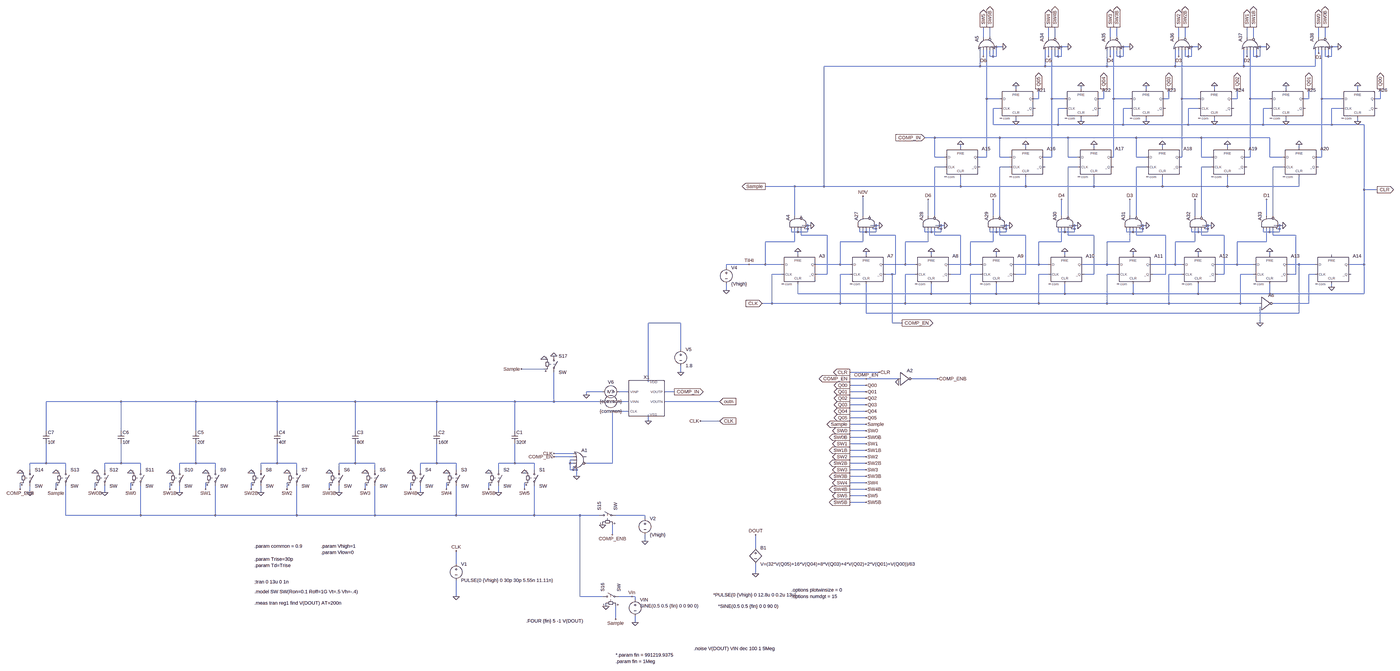
[diagram p0: schematic saradc.asc, whole sheet]
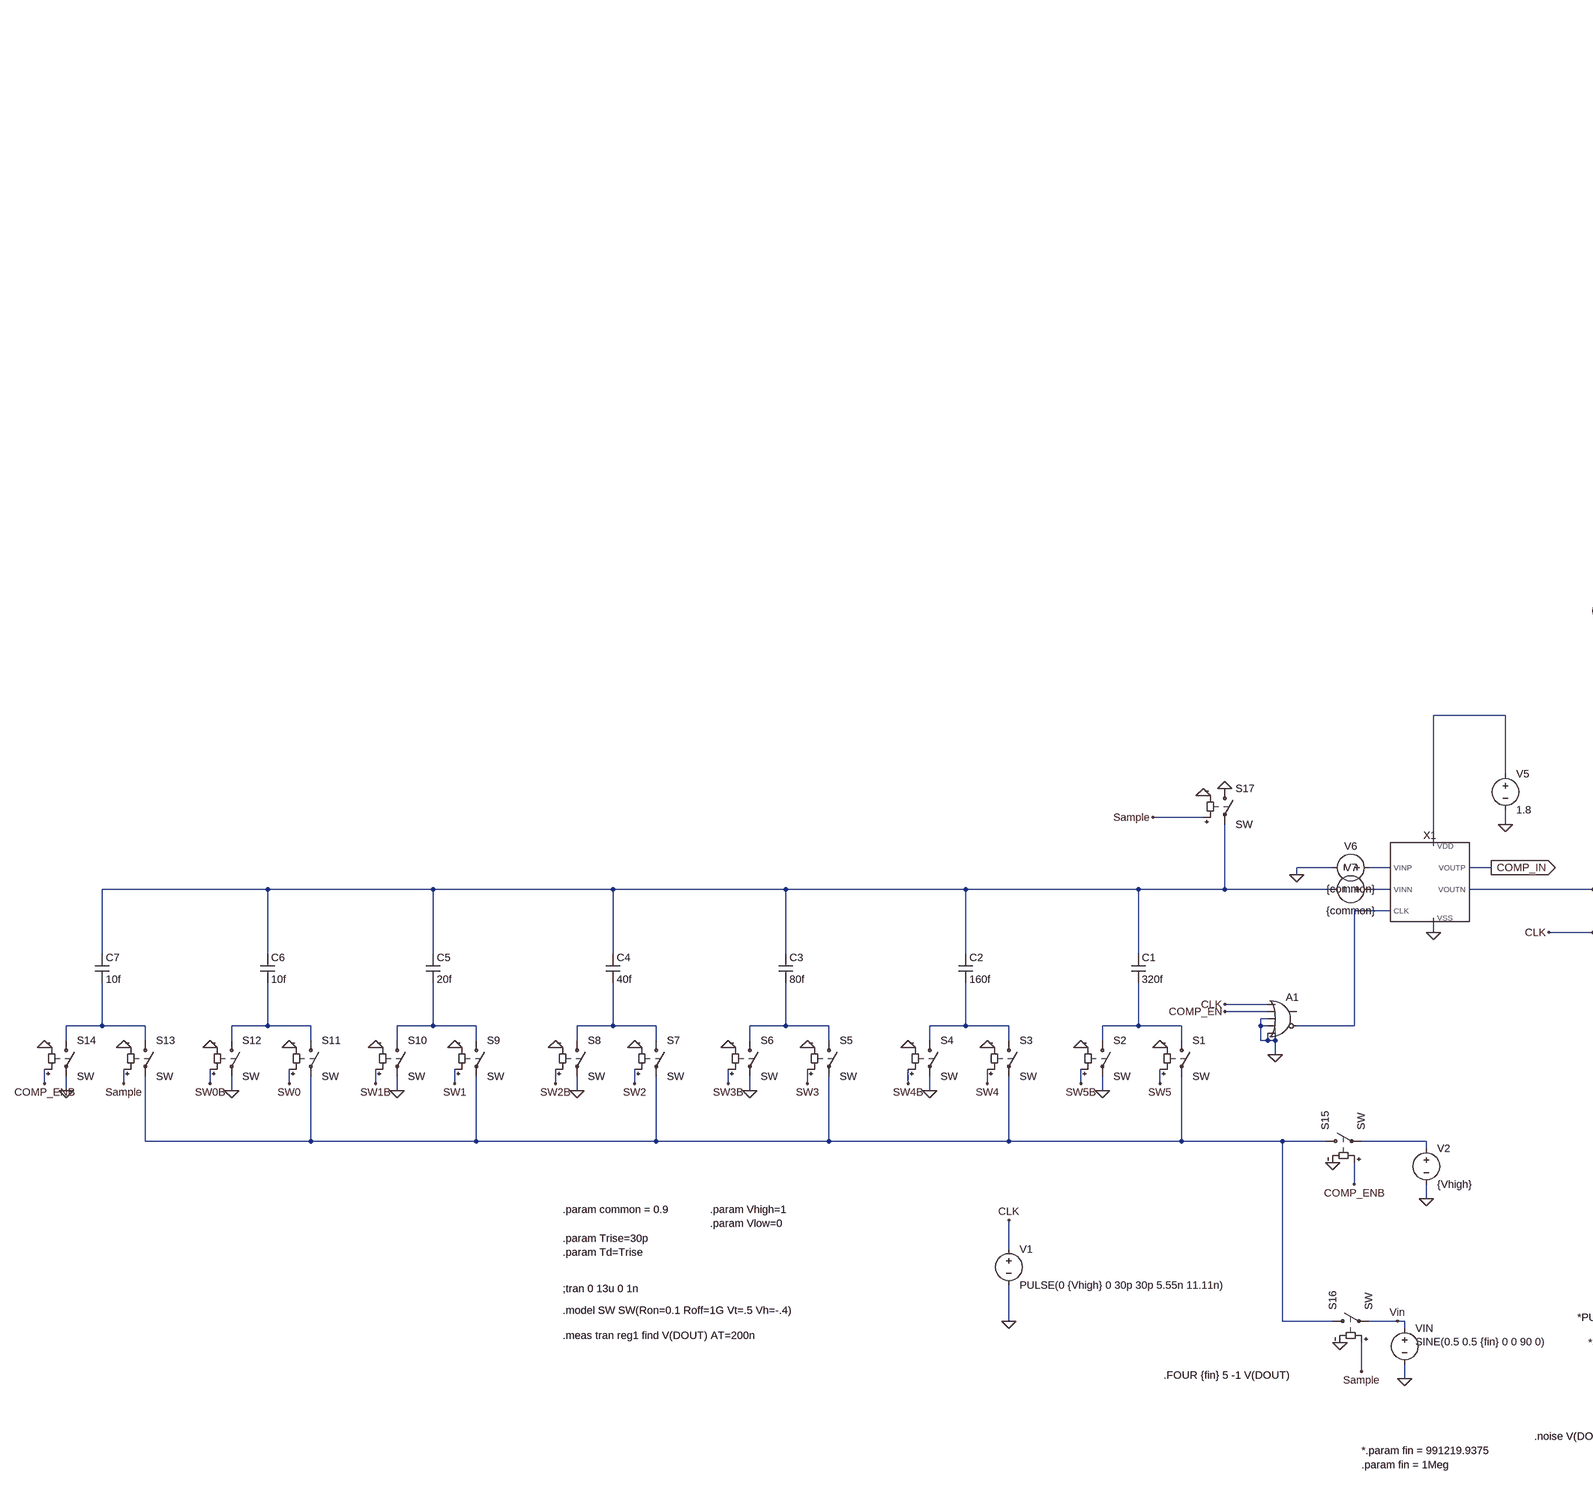
[diagram p1: schematic saradc.asc, part, row 1 of 1, column 1 of 2]
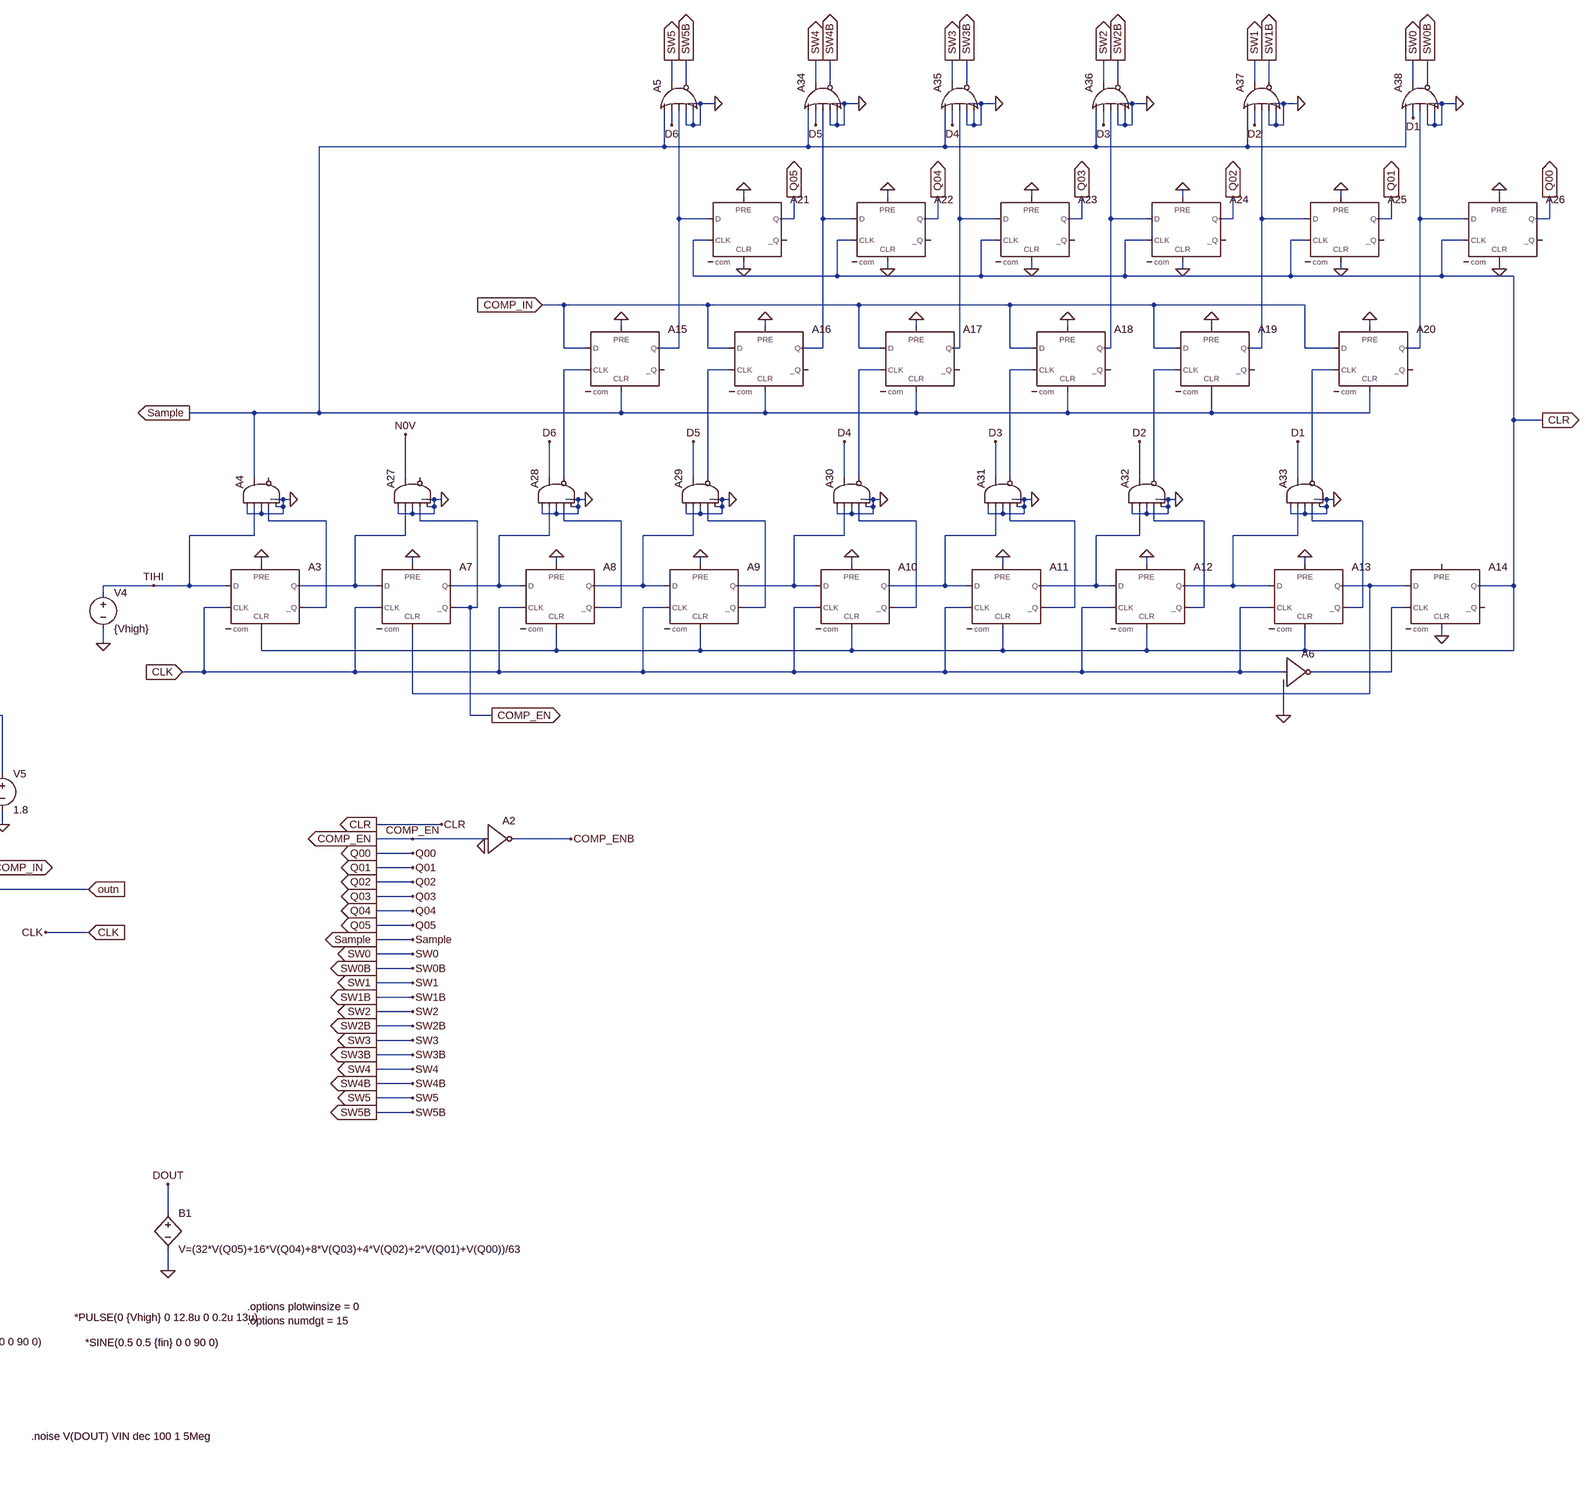
[diagram p2: schematic saradc.asc, part, row 1 of 1, column 2 of 2]
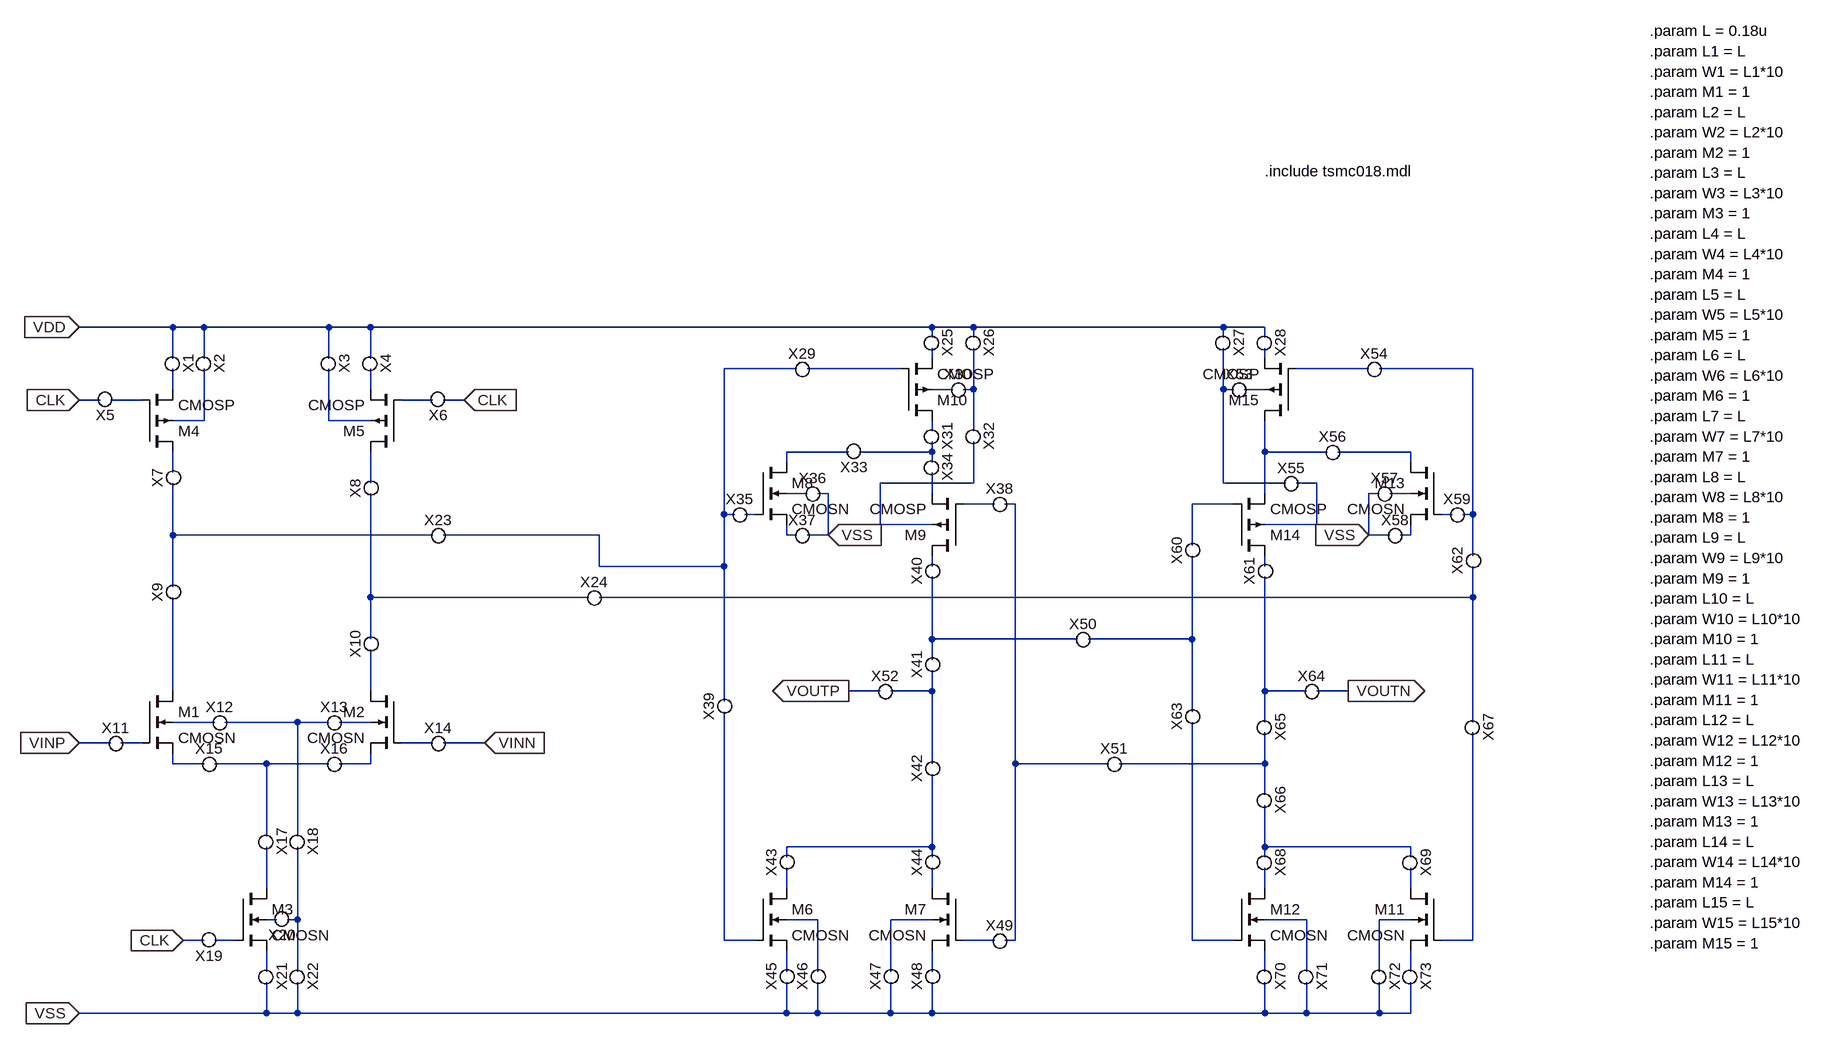
[diagram p3: sub-circuit my_comparator.asc]
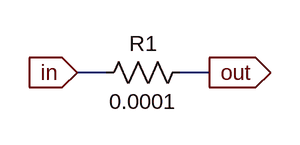
[diagram p4: sub-circuit para_register.asc]
saradc.asc, the LTspice schematic file:
Version 4
SHEET 1 4660 1216
WIRE 2576 -1872 2576 -1920
WIRE 2608 -1872 2608 -1920
WIRE 2896 -1872 2896 -1920
WIRE 2928 -1872 2928 -1920
WIRE 3200 -1872 3200 -1920
WIRE 3232 -1872 3232 -1920
WIRE 3536 -1872 3536 -1920
WIRE 3568 -1872 3568 -1920
WIRE 3872 -1872 3872 -1920
WIRE 3904 -1872 3904 -1920
WIRE 4224 -1872 4224 -1920
WIRE 4256 -1872 4256 -1920
WIRE 2640 -1824 2624 -1824
WIRE 2672 -1824 2640 -1824
WIRE 2960 -1824 2944 -1824
WIRE 2992 -1824 2960 -1824
WIRE 3264 -1824 3248 -1824
WIRE 3296 -1824 3264 -1824
WIRE 3600 -1824 3584 -1824
WIRE 3632 -1824 3600 -1824
WIRE 3936 -1824 3920 -1824
WIRE 3968 -1824 3936 -1824
WIRE 4288 -1824 4272 -1824
WIRE 4320 -1824 4288 -1824
WIRE 4224 -1792 4224 -1808
WIRE 2576 -1776 2576 -1808
WIRE 2608 -1776 2608 -1808
WIRE 2624 -1776 2624 -1808
WIRE 2624 -1776 2608 -1776
WIRE 2640 -1776 2640 -1824
WIRE 2640 -1776 2624 -1776
WIRE 2896 -1776 2896 -1808
WIRE 2928 -1776 2928 -1808
WIRE 2944 -1776 2944 -1808
WIRE 2944 -1776 2928 -1776
WIRE 2960 -1776 2960 -1824
WIRE 2960 -1776 2944 -1776
WIRE 3200 -1776 3200 -1808
WIRE 3232 -1776 3232 -1808
WIRE 3248 -1776 3248 -1808
WIRE 3248 -1776 3232 -1776
WIRE 3264 -1776 3264 -1824
WIRE 3264 -1776 3248 -1776
WIRE 3536 -1776 3536 -1808
WIRE 3568 -1776 3568 -1808
WIRE 3584 -1776 3584 -1808
WIRE 3584 -1776 3568 -1776
WIRE 3600 -1776 3600 -1824
WIRE 3600 -1776 3584 -1776
WIRE 3872 -1776 3872 -1808
WIRE 3904 -1776 3904 -1808
WIRE 3920 -1776 3920 -1808
WIRE 3920 -1776 3904 -1776
WIRE 3936 -1776 3936 -1824
WIRE 3936 -1776 3920 -1776
WIRE 4256 -1776 4256 -1808
WIRE 4272 -1776 4272 -1808
WIRE 4272 -1776 4256 -1776
WIRE 4288 -1776 4288 -1824
WIRE 4288 -1776 4272 -1776
WIRE 2560 -1728 2560 -1808
WIRE 2560 -1728 1792 -1728
WIRE 2880 -1728 2880 -1808
WIRE 2880 -1728 2560 -1728
WIRE 3184 -1728 3184 -1808
WIRE 3184 -1728 2880 -1728
WIRE 3520 -1728 3520 -1808
WIRE 3520 -1728 3184 -1728
WIRE 3856 -1728 3856 -1808
WIRE 3856 -1728 3520 -1728
WIRE 4208 -1728 4208 -1808
WIRE 4208 -1728 3856 -1728
WIRE 2736 -1616 2736 -1632
WIRE 3056 -1616 3056 -1632
WIRE 3376 -1616 3376 -1632
WIRE 3712 -1616 3712 -1632
WIRE 4064 -1616 4064 -1632
WIRE 4416 -1616 4416 -1632
WIRE 2592 -1568 2592 -1808
WIRE 2656 -1568 2592 -1568
WIRE 2848 -1568 2848 -1616
WIRE 2848 -1568 2816 -1568
WIRE 2912 -1568 2912 -1808
WIRE 2976 -1568 2912 -1568
WIRE 3168 -1568 3168 -1616
WIRE 3168 -1568 3136 -1568
WIRE 3216 -1568 3216 -1808
WIRE 3296 -1568 3216 -1568
WIRE 3488 -1568 3488 -1616
WIRE 3488 -1568 3456 -1568
WIRE 3552 -1568 3552 -1808
WIRE 3632 -1568 3552 -1568
WIRE 3824 -1568 3824 -1616
WIRE 3824 -1568 3792 -1568
WIRE 3888 -1568 3888 -1808
WIRE 3984 -1568 3888 -1568
WIRE 4176 -1568 4176 -1616
WIRE 4176 -1568 4144 -1568
WIRE 4240 -1568 4240 -1808
WIRE 4336 -1568 4240 -1568
WIRE 4528 -1568 4528 -1616
WIRE 4528 -1568 4496 -1568
WIRE 2656 -1520 2624 -1520
WIRE 2976 -1520 2944 -1520
WIRE 3296 -1520 3264 -1520
WIRE 3632 -1520 3584 -1520
WIRE 3984 -1520 3952 -1520
WIRE 4336 -1520 4288 -1520
WIRE 2736 -1456 2736 -1472
WIRE 3056 -1456 3056 -1472
WIRE 3376 -1456 3376 -1472
WIRE 3712 -1456 3712 -1472
WIRE 4064 -1456 4064 -1472
WIRE 4416 -1456 4416 -1472
WIRE 2624 -1440 2624 -1520
WIRE 2944 -1440 2944 -1520
WIRE 2944 -1440 2624 -1440
WIRE 3264 -1440 3264 -1520
WIRE 3264 -1440 2944 -1440
WIRE 3584 -1440 3584 -1520
WIRE 3584 -1440 3264 -1440
WIRE 3952 -1440 3952 -1520
WIRE 3952 -1440 3584 -1440
WIRE 4288 -1440 4288 -1520
WIRE 4288 -1440 3952 -1440
WIRE 4448 -1440 4288 -1440
WIRE 2336 -1376 2288 -1376
WIRE 2656 -1376 2336 -1376
WIRE 2992 -1376 2656 -1376
WIRE 3328 -1376 2992 -1376
WIRE 3648 -1376 3328 -1376
WIRE 3984 -1376 3648 -1376
WIRE 2464 -1328 2464 -1344
WIRE 2784 -1328 2784 -1344
WIRE 3120 -1328 3120 -1344
WIRE 3456 -1328 3456 -1344
WIRE 3776 -1328 3776 -1344
WIRE 4128 -1328 4128 -1344
WIRE 2336 -1280 2336 -1376
WIRE 2384 -1280 2336 -1280
WIRE 2592 -1280 2592 -1568
WIRE 2592 -1280 2544 -1280
WIRE 2656 -1280 2656 -1376
WIRE 2704 -1280 2656 -1280
WIRE 2912 -1280 2912 -1568
WIRE 2912 -1280 2864 -1280
WIRE 2992 -1280 2992 -1376
WIRE 3040 -1280 2992 -1280
WIRE 3216 -1280 3216 -1568
WIRE 3216 -1280 3200 -1280
WIRE 3328 -1280 3328 -1376
WIRE 3376 -1280 3328 -1280
WIRE 3552 -1280 3552 -1568
WIRE 3552 -1280 3536 -1280
WIRE 3648 -1280 3648 -1376
WIRE 3696 -1280 3648 -1280
WIRE 3888 -1280 3888 -1568
WIRE 3888 -1280 3856 -1280
WIRE 3984 -1280 3984 -1376
WIRE 4048 -1280 3984 -1280
WIRE 4240 -1280 4240 -1568
WIRE 4240 -1280 4208 -1280
WIRE 2384 -1232 2336 -1232
WIRE 2704 -1232 2656 -1232
WIRE 3040 -1232 2992 -1232
WIRE 3376 -1232 3328 -1232
WIRE 3696 -1232 3648 -1232
WIRE 4048 -1232 4000 -1232
WIRE 1648 -1136 1504 -1136
WIRE 1792 -1136 1792 -1728
WIRE 1792 -1136 1648 -1136
WIRE 2464 -1136 2464 -1184
WIRE 2464 -1136 1792 -1136
WIRE 2784 -1136 2784 -1184
WIRE 2784 -1136 2464 -1136
WIRE 3120 -1136 3120 -1184
WIRE 3120 -1136 2784 -1136
WIRE 3456 -1136 3456 -1184
WIRE 3456 -1136 3120 -1136
WIRE 3776 -1136 3776 -1184
WIRE 3776 -1136 3456 -1136
WIRE 4128 -1136 4128 -1184
WIRE 4128 -1136 3776 -1136
WIRE 4448 -1120 4448 -1440
WIRE 4512 -1120 4448 -1120
WIRE 1648 -992 1648 -1136
WIRE 1984 -992 1984 -1088
WIRE 2304 -992 2304 -1072
WIRE 2336 -992 2336 -1232
WIRE 2624 -992 2624 -1072
WIRE 2656 -992 2656 -1232
WIRE 2960 -992 2960 -1072
WIRE 2992 -992 2992 -1232
WIRE 3296 -992 3296 -1072
WIRE 3328 -992 3328 -1232
WIRE 3616 -992 3616 -1072
WIRE 3648 -992 3648 -1232
WIRE 3968 -992 3968 -1072
WIRE 4000 -992 4000 -1232
WIRE 1712 -944 1696 -944
WIRE 1728 -944 1712 -944
WIRE 2048 -944 2032 -944
WIRE 2064 -944 2048 -944
WIRE 2368 -944 2352 -944
WIRE 2384 -944 2368 -944
WIRE 2688 -944 2672 -944
WIRE 2704 -944 2688 -944
WIRE 3024 -944 3008 -944
WIRE 3040 -944 3024 -944
WIRE 3360 -944 3344 -944
WIRE 3376 -944 3360 -944
WIRE 3680 -944 3664 -944
WIRE 3696 -944 3680 -944
WIRE 4032 -944 4016 -944
WIRE 4048 -944 4032 -944
WIRE 1712 -928 1712 -944
WIRE 1712 -928 1696 -928
WIRE 2048 -928 2048 -944
WIRE 2048 -928 2032 -928
WIRE 2368 -928 2368 -944
WIRE 2368 -928 2352 -928
WIRE 2688 -928 2688 -944
WIRE 2688 -928 2672 -928
WIRE 3024 -928 3024 -944
WIRE 3024 -928 3008 -928
WIRE 3360 -928 3360 -944
WIRE 3360 -928 3344 -928
WIRE 3680 -928 3680 -944
WIRE 3680 -928 3664 -928
WIRE 4032 -928 4032 -944
WIRE 4032 -928 4016 -928
WIRE 1632 -912 1632 -928
WIRE 1664 -912 1664 -928
WIRE 1664 -912 1632 -912
WIRE 1712 -912 1712 -928
WIRE 1712 -912 1664 -912
WIRE 1968 -912 1968 -928
WIRE 2000 -912 2000 -928
WIRE 2000 -912 1968 -912
WIRE 2048 -912 2048 -928
WIRE 2048 -912 2000 -912
WIRE 2288 -912 2288 -928
WIRE 2320 -912 2320 -928
WIRE 2320 -912 2288 -912
WIRE 2368 -912 2368 -928
WIRE 2368 -912 2320 -912
WIRE 2608 -912 2608 -928
WIRE 2640 -912 2640 -928
WIRE 2640 -912 2608 -912
WIRE 2688 -912 2688 -928
WIRE 2688 -912 2640 -912
WIRE 2944 -912 2944 -928
WIRE 2976 -912 2976 -928
WIRE 2976 -912 2944 -912
WIRE 3024 -912 3024 -928
WIRE 3024 -912 2976 -912
WIRE 3280 -912 3280 -928
WIRE 3312 -912 3312 -928
WIRE 3312 -912 3280 -912
WIRE 3360 -912 3360 -928
WIRE 3360 -912 3312 -912
WIRE 3600 -912 3600 -928
WIRE 3632 -912 3632 -928
WIRE 3632 -912 3600 -912
WIRE 3680 -912 3680 -928
WIRE 3680 -912 3632 -912
WIRE 3952 -912 3952 -928
WIRE 3984 -912 3984 -928
WIRE 3984 -912 3952 -912
WIRE 4032 -912 4032 -928
WIRE 4032 -912 3984 -912
WIRE 1680 -896 1680 -928
WIRE 1808 -896 1680 -896
WIRE 2016 -896 2016 -928
WIRE 2144 -896 2016 -896
WIRE 2336 -896 2336 -928
WIRE 2464 -896 2336 -896
WIRE 2656 -896 2656 -928
WIRE 2784 -896 2656 -896
WIRE 2992 -896 2992 -928
WIRE 3120 -896 2992 -896
WIRE 3328 -896 3328 -928
WIRE 3472 -896 3328 -896
WIRE 3648 -896 3648 -928
WIRE 3760 -896 3648 -896
WIRE 4000 -896 4000 -928
WIRE 4112 -896 4000 -896
WIRE 1648 -864 1648 -928
WIRE 1648 -864 1504 -864
WIRE 1984 -864 1984 -928
WIRE 1984 -864 1872 -864
WIRE 2304 -864 2304 -928
WIRE 2304 -864 2192 -864
WIRE 2624 -864 2624 -928
WIRE 2624 -864 2512 -864
WIRE 2960 -864 2960 -928
WIRE 2960 -864 2848 -864
WIRE 3296 -864 3296 -928
WIRE 3296 -864 3184 -864
WIRE 3616 -864 3616 -928
WIRE 3616 -864 3520 -864
WIRE 3968 -864 3968 -928
WIRE 3968 -864 3824 -864
WIRE 1664 -800 1664 -816
WIRE 2000 -800 2000 -816
WIRE 2320 -800 2320 -816
WIRE 2640 -800 2640 -816
WIRE 2976 -800 2976 -816
WIRE 3312 -800 3312 -816
WIRE 3632 -800 3632 -816
WIRE 3984 -800 3984 -816
WIRE 1424 -752 1312 -752
WIRE 1504 -752 1504 -864
WIRE 1504 -752 1424 -752
WIRE 1584 -752 1504 -752
WIRE 1872 -752 1872 -864
WIRE 1872 -752 1744 -752
WIRE 1920 -752 1872 -752
WIRE 2192 -752 2192 -864
WIRE 2192 -752 2080 -752
WIRE 2240 -752 2192 -752
WIRE 2512 -752 2512 -864
WIRE 2512 -752 2400 -752
WIRE 2560 -752 2512 -752
WIRE 2848 -752 2848 -864
WIRE 2848 -752 2720 -752
WIRE 2896 -752 2848 -752
WIRE 3184 -752 3184 -864
WIRE 3184 -752 3056 -752
WIRE 3232 -752 3184 -752
WIRE 3520 -752 3520 -864
WIRE 3520 -752 3392 -752
WIRE 3552 -752 3520 -752
WIRE 3824 -752 3824 -864
WIRE 3824 -752 3712 -752
WIRE 3904 -752 3824 -752
WIRE 4128 -752 4064 -752
WIRE 4208 -752 4128 -752
WIRE 4448 -752 4448 -1120
WIRE 4448 -752 4368 -752
WIRE 1312 -736 1312 -752
WIRE 1584 -704 1536 -704
WIRE 1808 -704 1808 -896
WIRE 1808 -704 1760 -704
WIRE 1920 -704 1872 -704
WIRE 2128 -704 2096 -704
WIRE 2144 -704 2144 -896
WIRE 2144 -704 2128 -704
WIRE 2240 -704 2192 -704
WIRE 2464 -704 2464 -896
WIRE 2464 -704 2416 -704
WIRE 2560 -704 2512 -704
WIRE 2784 -704 2784 -896
WIRE 2784 -704 2736 -704
WIRE 2896 -704 2848 -704
WIRE 3120 -704 3120 -896
WIRE 3120 -704 3072 -704
WIRE 3232 -704 3184 -704
WIRE 3472 -704 3472 -896
WIRE 3472 -704 3408 -704
WIRE 3552 -704 3488 -704
WIRE 3760 -704 3760 -896
WIRE 3760 -704 3728 -704
WIRE 3904 -704 3840 -704
WIRE 4112 -704 4112 -896
WIRE 4112 -704 4080 -704
WIRE 4208 -704 4176 -704
WIRE 4288 -640 4288 -656
WIRE 1312 -624 1312 -656
WIRE 1664 -608 1664 -656
WIRE 2320 -608 2320 -656
WIRE 2320 -608 1664 -608
WIRE 2640 -608 2640 -656
WIRE 2640 -608 2320 -608
WIRE 2976 -608 2976 -656
WIRE 2976 -608 2640 -608
WIRE 3312 -608 3312 -656
WIRE 3312 -608 2976 -608
WIRE 3632 -608 3632 -656
WIRE 3632 -608 3312 -608
WIRE 3984 -608 3984 -656
WIRE 3984 -608 3632 -608
WIRE 4448 -608 4448 -752
WIRE 4448 -608 3984 -608
WIRE 1536 -560 1536 -704
WIRE 1536 -560 1488 -560
WIRE 1872 -560 1872 -704
WIRE 1872 -560 1536 -560
WIRE 2192 -560 2192 -704
WIRE 2192 -560 1872 -560
WIRE 2512 -560 2512 -704
WIRE 2512 -560 2192 -560
WIRE 2848 -560 2848 -704
WIRE 2848 -560 2512 -560
WIRE 3184 -560 3184 -704
WIRE 3184 -560 2848 -560
WIRE 3488 -560 3488 -704
WIRE 3488 -560 3184 -560
WIRE 3840 -560 3840 -704
WIRE 3840 -560 3488 -560
WIRE 3936 -560 3840 -560
WIRE 4176 -560 4176 -704
WIRE 4176 -560 4000 -560
WIRE 2000 -512 2000 -656
WIRE 4128 -512 4128 -752
WIRE 4128 -512 2000 -512
WIRE 1088 -464 928 -464
WIRE 2128 -464 2128 -704
WIRE 2176 -464 2128 -464
WIRE 3936 -464 3936 -544
WIRE 1088 -320 1088 -464
WIRE 416 -224 304 -224
WIRE 1088 -208 1088 -240
WIRE 2064 -208 1920 -208
WIRE 2000 -176 1920 -176
WIRE 2160 -176 2000 -176
WIRE 2352 -176 2224 -176
WIRE 928 -160 928 -464
WIRE 2000 -144 1920 -144
WIRE 704 -112 624 -112
WIRE 832 -112 784 -112
WIRE 1056 -112 1008 -112
WIRE 2000 -112 1920 -112
WIRE 624 -96 624 -112
WIRE 2000 -80 1920 -80
WIRE -1664 -64 -2032 -64
WIRE -1296 -64 -1664 -64
WIRE -896 -64 -1296 -64
WIRE -512 -64 -896 -64
WIRE -112 -64 -512 -64
WIRE 272 -64 -112 -64
WIRE 464 -64 464 -208
WIRE 464 -64 272 -64
WIRE 704 -64 464 -64
WIRE 832 -64 784 -64
WIRE 1280 -64 1008 -64
WIRE 2000 -48 1920 -48
WIRE 832 -16 752 -16
WIRE 2000 -16 1920 -16
WIRE 2000 16 1920 16
WIRE 928 32 928 0
WIRE 1280 32 1184 32
WIRE 2000 48 1920 48
WIRE -2032 80 -2032 -64
WIRE -1664 80 -1664 -64
WIRE -1296 80 -1296 -64
WIRE -896 80 -896 -64
WIRE -512 80 -512 -64
WIRE -112 80 -112 -64
WIRE 272 80 272 -64
WIRE 2000 80 1920 80
WIRE 2000 112 1920 112
WIRE 2000 144 1920 144
WIRE 2000 176 1920 176
WIRE 560 192 464 192
WIRE 560 208 464 208
WIRE 2000 208 1920 208
WIRE 560 224 544 224
WIRE -2032 240 -2032 144
WIRE -2032 240 -2112 240
WIRE -1936 240 -2032 240
WIRE -1664 240 -1664 144
WIRE -1664 240 -1744 240
WIRE -1568 240 -1664 240
WIRE -1296 240 -1296 144
WIRE -1296 240 -1376 240
WIRE -1200 240 -1296 240
WIRE -896 240 -896 144
WIRE -896 240 -976 240
WIRE -800 240 -896 240
WIRE -512 240 -512 144
WIRE -512 240 -592 240
WIRE -416 240 -512 240
WIRE -112 240 -112 144
WIRE -112 240 -192 240
WIRE -16 240 -112 240
WIRE 272 240 272 144
WIRE 272 240 192 240
WIRE 368 240 272 240
WIRE 544 240 544 224
WIRE 560 240 544 240
WIRE 752 240 752 -16
WIRE 752 240 624 240
WIRE 2000 240 1920 240
WIRE -2112 272 -2112 240
WIRE -1936 272 -1936 240
WIRE -1744 272 -1744 240
WIRE -1568 272 -1568 240
WIRE -1376 272 -1376 240
WIRE -1200 272 -1200 240
WIRE -976 272 -976 240
WIRE -800 272 -800 240
WIRE -592 272 -592 240
WIRE -416 272 -416 240
WIRE -192 272 -192 240
WIRE -16 272 -16 240
WIRE 192 272 192 240
WIRE 368 272 368 240
WIRE 544 272 544 240
WIRE 560 272 560 256
WIRE 560 272 544 272
WIRE 576 272 576 256
WIRE 576 272 560 272
WIRE 2000 272 1920 272
WIRE 576 304 576 272
WIRE 2000 304 1920 304
WIRE 2000 336 1920 336
WIRE -2160 368 -2160 336
WIRE -1984 368 -1984 336
WIRE -1792 368 -1792 336
WIRE -1616 368 -1616 336
WIRE -1424 368 -1424 336
WIRE -1248 368 -1248 336
WIRE -1024 368 -1024 336
WIRE -848 368 -848 336
WIRE -640 368 -640 336
WIRE -464 368 -464 336
WIRE -240 368 -240 336
WIRE -64 368 -64 336
WIRE 144 368 144 336
WIRE 320 368 320 336
WIRE 2000 368 1920 368
WIRE -2112 384 -2112 352
WIRE -1744 384 -1744 352
WIRE -1376 384 -1376 352
WIRE -976 384 -976 352
WIRE -592 384 -592 352
WIRE -192 384 -192 352
WIRE 192 384 192 352
WIRE 2000 400 1920 400
WIRE 2000 432 1920 432
WIRE -1936 496 -1936 352
WIRE -1568 496 -1568 352
WIRE -1568 496 -1936 496
WIRE -1200 496 -1200 352
WIRE -1200 496 -1568 496
WIRE -800 496 -800 352
WIRE -800 496 -1200 496
WIRE -416 496 -416 352
WIRE -416 496 -800 496
WIRE -16 496 -16 352
WIRE -16 496 -416 496
WIRE 368 496 368 352
WIRE 368 496 -16 496
WIRE 592 496 368 496
WIRE 688 496 592 496
WIRE 912 496 768 496
WIRE 912 512 912 496
WIRE 752 592 752 544
WIRE 912 624 912 592
WIRE 1456 656 1456 592
WIRE -16 736 -16 672
WIRE 1456 784 1456 736
WIRE -16 896 -16 816
WIRE 592 896 592 496
WIRE 704 896 592 896
WIRE 848 896 784 896
WIRE 864 896 848 896
WIRE 864 912 864 896
WIRE 768 1008 768 944
WIRE 864 1024 864 992
FLAG 192 384 0
FLAG 320 288 0
FLAG 144 288 0
FLAG 320 368 SW5
FLAG 144 368 SW5B
FLAG -192 384 0
FLAG -64 288 0
FLAG -240 288 0
FLAG -64 368 SW4
FLAG -240 368 SW4B
FLAG -592 384 0
FLAG -464 288 0
FLAG -640 288 0
FLAG -464 368 SW3
FLAG -640 368 SW3B
FLAG -976 384 0
FLAG -848 288 0
FLAG -1024 288 0
FLAG -848 368 SW2
FLAG -1024 368 SW2B
FLAG -1376 384 0
FLAG -1248 288 0
FLAG -1424 288 0
FLAG -1248 368 SW1
FLAG -1424 368 SW1B
FLAG -1744 384 0
FLAG -1616 288 0
FLAG -1792 288 0
FLAG -1616 368 SW0
FLAG -1792 368 SW0B
FLAG -2112 384 0
FLAG -1984 288 0
FLAG -2160 288 0
FLAG -1984 368 Sample
FLAG -2160 368 COMP_ENB
FLAG 704 544 0
FLAG 752 592 COMP_ENB
FLAG 720 944 0
FLAG 768 1008 Sample
FLAG 912 624 0
FLAG -16 896 0
FLAG -16 672 CLK
FLAG 864 1024 0
FLAG 464 -288 0
FLAG 416 -272 0
FLAG 304 -224 Sample
FLAG 576 304 0
FLAG 464 192 CLK
FLAG 464 208 COMP_EN
FLAG 1184 32 CLK
FLAG 2000 -176 COMP_EN
FLAG 2000 -144 Q00
FLAG 2000 -112 Q01
FLAG 2000 -80 Q02
FLAG 2000 -48 Q03
FLAG 2000 -16 Q04
FLAG 2000 16 Q05
FLAG 2000 48 Sample
FLAG 2000 80 SW0
FLAG 2000 112 SW0B
FLAG 2000 144 SW1
FLAG 2000 176 SW1B
FLAG 2000 208 SW2
FLAG 2000 240 SW2B
FLAG 2000 272 SW3
FLAG 2000 304 SW3B
FLAG 2000 336 SW4
FLAG 2000 368 SW4B
FLAG 2000 400 SW5
FLAG 2000 432 SW5B
FLAG 2352 -176 COMP_ENB
FLAG 2160 -160 0
FLAG 1456 784 0
FLAG 1456 592 DOUT
FLAG 624 -96 0
FLAG 2064 -208 CLR
FLAG 2672 -1824 0
FLAG 2464 -1344 0
FLAG 2784 -1344 0
FLAG 3120 -1344 0
FLAG 3456 -1344 0
FLAG 3776 -1344 0
FLAG 4128 -1344 0
FLAG 2736 -1632 0
FLAG 3056 -1632 0
FLAG 3376 -1632 0
FLAG 3712 -1632 0
FLAG 4064 -1632 0
FLAG 4416 -1632 0
FLAG 2736 -1456 0
FLAG 3056 -1456 0
FLAG 3376 -1456 0
FLAG 3712 -1456 0
FLAG 4064 -1456 0
FLAG 4416 -1456 0
FLAG 1728 -944 0
FLAG 1664 -816 0
FLAG 2000 -816 0
FLAG 2320 -816 0
FLAG 2640 -816 0
FLAG 2976 -816 0
FLAG 3312 -816 0
FLAG 3632 -816 0
FLAG 3984 -816 0
FLAG 2064 -944 0
FLAG 2384 -944 0
FLAG 2704 -944 0
FLAG 3040 -944 0
FLAG 3376 -944 0
FLAG 3696 -944 0
FLAG 4048 -944 0
FLAG 2992 -1824 0
FLAG 3296 -1824 0
FLAG 3632 -1824 0
FLAG 3968 -1824 0
FLAG 4320 -1824 0
FLAG 1488 -560 CLK
IOPIN 1488 -560 In
FLAG 2288 -1376 COMP_IN
IOPIN 2288 -1376 In
FLAG 2176 -464 COMP_EN
IOPIN 2176 -464 Out
FLAG 1312 -624 0
FLAG 4288 -640 0
FLAG 3936 -464 0
FLAG 1504 -1136 Sample
IOPIN 1504 -1136 Out
FLAG 2304 -1072 D6
FLAG 2624 -1072 D5
FLAG 2960 -1072 D4
FLAG 3296 -1072 D3
FLAG 3616 -1072 D2
FLAG 3968 -1072 D1
FLAG 2848 -1616 Q05
IOPIN 2848 -1616 Out
FLAG 3168 -1616 Q04
IOPIN 3168 -1616 Out
FLAG 3488 -1616 Q03
IOPIN 3488 -1616 Out
FLAG 3824 -1616 Q02
IOPIN 3824 -1616 Out
FLAG 4176 -1616 Q01
IOPIN 4176 -1616 Out
FLAG 4528 -1616 Q00
IOPIN 4528 -1616 Out
FLAG 2576 -1776 D6
FLAG 2896 -1776 D5
FLAG 3200 -1776 D4
FLAG 3536 -1776 D3
FLAG 3872 -1776 D2
FLAG 4224 -1792 D1
FLAG 2576 -1920 SW5
IOPIN 2576 -1920 Out
FLAG 2608 -1920 SW5B
IOPIN 2608 -1920 Out
FLAG 2896 -1920 SW4
IOPIN 2896 -1920 Out
FLAG 2928 -1920 SW4B
IOPIN 2928 -1920 Out
FLAG 3200 -1920 SW3
IOPIN 3200 -1920 Out
FLAG 3232 -1920 SW3B
IOPIN 3232 -1920 Out
FLAG 3536 -1920 SW2
IOPIN 3536 -1920 Out
FLAG 3568 -1920 SW2B
IOPIN 3568 -1920 Out
FLAG 3872 -1920 SW1
IOPIN 3872 -1920 Out
FLAG 3904 -1920 SW1B
IOPIN 3904 -1920 Out
FLAG 4224 -1920 SW0
IOPIN 4224 -1920 Out
FLAG 4256 -1920 SW0B
IOPIN 4256 -1920 Out
FLAG 1424 -752 TIHI
FLAG 1984 -1088 N0V
FLAG 4512 -1120 CLR
IOPIN 4512 -1120 Out
FLAG 1280 32 CLK
IOPIN 1280 32 In
FLAG 1280 -64 outn
IOPIN 1280 -64 In
FLAG 1920 -208 CLR
IOPIN 1920 -208 Out
FLAG 1920 -176 COMP_EN
IOPIN 1920 -176 Out
FLAG 1920 -144 Q00
IOPIN 1920 -144 Out
FLAG 1920 -112 Q01
IOPIN 1920 -112 Out
FLAG 1920 -80 Q02
IOPIN 1920 -80 Out
FLAG 1920 -48 Q03
IOPIN 1920 -48 Out
FLAG 1920 -16 Q04
IOPIN 1920 -16 Out
FLAG 1920 16 Q05
IOPIN 1920 16 Out
FLAG 1920 48 Sample
IOPIN 1920 48 Out
FLAG 1920 80 SW0
IOPIN 1920 80 Out
FLAG 1920 112 SW0B
IOPIN 1920 112 Out
FLAG 1920 144 SW1
IOPIN 1920 144 Out
FLAG 1920 176 SW1B
IOPIN 1920 176 Out
FLAG 1920 208 SW2
IOPIN 1920 208 Out
FLAG 1920 240 SW2B
IOPIN 1920 240 Out
FLAG 1920 272 SW3
IOPIN 1920 272 Out
FLAG 1920 304 SW3B
IOPIN 1920 304 Out
FLAG 1920 336 SW4
IOPIN 1920 336 Out
FLAG 1920 368 SW4B
IOPIN 1920 368 Out
FLAG 1920 400 SW5
IOPIN 1920 400 Out
FLAG 1920 432 SW5B
IOPIN 1920 432 Out
FLAG 1088 -208 0
FLAG 928 32 0
FLAG 1056 -112 COMP_IN
IOPIN 1056 -112 Out
FLAG 848 896 Vin
SYMBOL cap 256 80 R0
SYMATTR InstName C1
SYMATTR Value 320f
SYMBOL sw 368 256 R0
SYMATTR InstName S1
SYMBOL sw 192 256 R0
SYMATTR InstName S2
SYMBOL cap -128 80 R0
SYMATTR InstName C2
SYMATTR Value 160f
SYMBOL sw -16 256 R0
SYMATTR InstName S3
SYMBOL sw -192 256 R0
SYMATTR InstName S4
SYMBOL cap -528 80 R0
SYMATTR InstName C3
SYMATTR Value 80f
SYMBOL sw -416 256 R0
SYMATTR InstName S5
SYMBOL sw -592 256 R0
SYMATTR InstName S6
SYMBOL cap -912 80 R0
SYMATTR InstName C4
SYMATTR Value 40f
SYMBOL sw -800 256 R0
SYMATTR InstName S7
SYMBOL sw -976 256 R0
SYMATTR InstName S8
SYMBOL cap -1312 80 R0
SYMATTR InstName C5
SYMATTR Value 20f
SYMBOL sw -1200 256 R0
SYMATTR InstName S9
SYMBOL sw -1376 256 R0
SYMATTR InstName S10
SYMBOL cap -1680 80 R0
SYMATTR InstName C6
SYMATTR Value 10f
SYMBOL sw -1568 256 R0
SYMATTR InstName S11
SYMBOL sw -1744 256 R0
SYMATTR InstName S12
SYMBOL cap -2048 80 R0
SYMATTR InstName C7
SYMATTR Value 10f
SYMBOL sw -1936 256 R0
SYMATTR InstName S13
SYMBOL sw -2112 256 R0
SYMATTR InstName S14
SYMBOL sw 672 496 R270
SYMATTR InstName S15
SYMBOL sw 688 896 R270
SYMATTR InstName S16
SYMBOL voltage -16 720 R0
WINDOW 123 0 0 Left 0
WINDOW 39 0 0 Left 0
SYMATTR InstName V1
SYMATTR Value PULSE(0 {Vhigh} 0 30p 30p 5.55n 11.11n)
SYMBOL voltage 912 496 R0
WINDOW 123 0 0 Left 0
WINDOW 39 0 0 Left 0
SYMATTR InstName V2
SYMATTR Value {Vhigh}
SYMBOL voltage 864 896 R0
WINDOW 123 0 0 Left 0
WINDOW 39 0 0 Left 0
WINDOW 3 24 46 Left 2
SYMATTR Value SINE(0.5 0.5 {fin} 0 0 90 0)
SYMATTR InstName VIN
SYMBOL sw 464 -304 R0
SYMATTR InstName S17
SYMBOL Digital\\or 592 160 R0
SYMATTR InstName A1
SYMATTR SpiceLine Trise={Trise} Td={Td} Vhigh={Vhigh}
SYMBOL Digital\\inv 2160 -240 R0
SYMATTR InstName A2
SYMATTR SpiceLine Vt=.5 Vh=0.1 Trise={Trise} Vhigh={Vhigh}
SYMBOL bv 1456 640 R0
SYMATTR InstName B1
SYMATTR Value V=(32*V(Q05)+16*V(Q04)+8*V(Q03)+4*V(Q02)+2*V(Q01)+V(Q00))/63
SYMBOL Digital\\dflop 1664 -800 R0
SYMATTR InstName A3
SYMATTR SpiceLine Vhigh={Vhigh} Vlow={Vlow} Td={Td} Trise={Trise}
SYMBOL Digital\\and 1600 -960 R270
SYMATTR InstName A4
SYMATTR SpiceLine Trise={Trise} Td={Td} Vhigh={Vhigh}
SYMBOL Digital\\or 2528 -1840 R270
SYMATTR InstName A5
SYMATTR SpiceLine Trise={Trise} Td={Td} Vhigh={Vhigh}
SYMBOL voltage 1312 -752 R0
WINDOW 123 0 0 Left 0
WINDOW 39 0 0 Left 0
SYMATTR InstName V4
SYMATTR Value {Vhigh}
SYMBOL Digital\\inv 3936 -624 R0
SYMATTR InstName A6
SYMATTR SpiceLine Trise={Trise} Vhigh={Vhigh}
SYMBOL Digital\\dflop 2000 -800 R0
SYMATTR InstName A7
SYMATTR SpiceLine Vhigh={Vhigh} Vlow={Vlow} Td={Td} Trise={Trise}
SYMBOL Digital\\dflop 2320 -800 R0
SYMATTR InstName A8
SYMATTR SpiceLine Vhigh={Vhigh} Vlow={Vlow} Td={Td} Trise={Trise}
SYMBOL Digital\\dflop 2640 -800 R0
SYMATTR InstName A9
SYMATTR SpiceLine Vhigh={Vhigh} Vlow={Vlow} Td={Td} Trise={Trise}
SYMBOL Digital\\dflop 2976 -800 R0
SYMATTR InstName A10
SYMATTR SpiceLine Vhigh={Vhigh} Vlow={Vlow} Td={Td} Trise={Trise}
SYMBOL Digital\\dflop 3312 -800 R0
SYMATTR InstName A11
SYMATTR SpiceLine Vhigh={Vhigh} Vlow={Vlow} Td={Td} Trise={Trise}
SYMBOL Digital\\dflop 3632 -800 R0
SYMATTR InstName A12
SYMATTR SpiceLine Vhigh={Vhigh} Vlow={Vlow} Td={Td} Trise={Trise}
SYMBOL Digital\\dflop 3984 -800 R0
SYMATTR InstName A13
SYMATTR SpiceLine Vhigh={Vhigh} Vlow={Vlow} Td={Td} Trise={Trise}
SYMBOL Digital\\dflop 4288 -800 R0
SYMATTR InstName A14
SYMATTR SpiceLine Vhigh={Vhigh} Vlow={Vlow} Td={Td} Trise={Trise}
SYMBOL Digital\\dflop 2464 -1328 R0
SYMATTR InstName A15
SYMATTR SpiceLine Vhigh={Vhigh} Vlow={Vlow} Td={Td} Trise={Trise}
SYMBOL Digital\\dflop 2784 -1328 R0
SYMATTR InstName A16
SYMATTR SpiceLine Vhigh={Vhigh} Vlow={Vlow} Td={Td} Trise={Trise}
SYMBOL Digital\\dflop 3120 -1328 R0
SYMATTR InstName A17
SYMATTR SpiceLine Vhigh={Vhigh} Vlow={Vlow} Td={Td} Trise={Trise}
SYMBOL Digital\\dflop 3456 -1328 R0
SYMATTR InstName A18
SYMATTR SpiceLine Vhigh={Vhigh} Vlow={Vlow} Td={Td} Trise={Trise}
SYMBOL Digital\\dflop 3776 -1328 R0
SYMATTR InstName A19
SYMATTR SpiceLine Vhigh={Vhigh} Vlow={Vlow} Td={Td} Trise={Trise}
SYMBOL Digital\\dflop 4128 -1328 R0
SYMATTR InstName A20
SYMATTR SpiceLine Vhigh={Vhigh} Vlow={Vlow} Td={Td} Trise={Trise}
SYMBOL Digital\\dflop 2736 -1616 R0
SYMATTR InstName A21
SYMATTR SpiceLine Vhigh={Vhigh} Vlow={Vlow} Td={Td} Trise={Trise}
SYMBOL Digital\\dflop 3056 -1616 R0
SYMATTR InstName A22
SYMATTR SpiceLine Vhigh={Vhigh} Vlow={Vlow} Td={Td} Trise={Trise}
SYMBOL Digital\\dflop 3376 -1616 R0
SYMATTR InstName A23
SYMATTR SpiceLine Vhigh={Vhigh} Vlow={Vlow} Td={Td} Trise={Trise}
SYMBOL Digital\\dflop 3712 -1616 R0
SYMATTR InstName A24
SYMATTR SpiceLine Vhigh={Vhigh} Vlow={Vlow} Td={Td} Trise={Trise}
SYMBOL Digital\\dflop 4064 -1616 R0
SYMATTR InstName A25
SYMATTR SpiceLine Vhigh={Vhigh} Vlow={Vlow} Td={Td} Trise={Trise}
SYMBOL Digital\\dflop 4416 -1616 R0
SYMATTR InstName A26
SYMATTR SpiceLine Vhigh={Vhigh} Vlow={Vlow} Td={Td} Trise={Trise}
SYMBOL Digital\\and 1936 -960 R270
SYMATTR InstName A27
SYMATTR SpiceLine Trise={Trise} Td={Td} Vhigh={Vhigh}
SYMBOL Digital\\and 2256 -960 R270
SYMATTR InstName A28
SYMATTR SpiceLine Trise={Trise} Td={Td} Vhigh={Vhigh}
SYMBOL Digital\\and 2576 -960 R270
SYMATTR InstName A29
SYMATTR SpiceLine Trise={Trise} Td={Td} Vhigh={Vhigh}
SYMBOL Digital\\and 2912 -960 R270
SYMATTR InstName A30
SYMATTR SpiceLine Trise={Trise} Td={Td} Vhigh={Vhigh}
SYMBOL Digital\\and 3248 -960 R270
SYMATTR InstName A31
SYMATTR SpiceLine Trise={Trise} Td={Td} Vhigh={Vhigh}
SYMBOL Digital\\and 3568 -960 R270
SYMATTR InstName A32
SYMATTR SpiceLine Trise={Trise} Td={Td} Vhigh={Vhigh}
SYMBOL Digital\\and 3920 -960 R270
SYMATTR InstName A33
SYMATTR SpiceLine Trise={Trise} Td={Td} Vhigh={Vhigh}
SYMBOL Digital\\or 2848 -1840 R270
SYMATTR InstName A34
SYMATTR SpiceLine Trise={Trise} Td={Td} Vhigh={Vhigh}
SYMBOL Digital\\or 3152 -1840 R270
SYMATTR InstName A35
SYMATTR SpiceLine Trise={Trise} Td={Td} Vhigh={Vhigh}
SYMBOL Digital\\or 3488 -1840 R270
SYMATTR InstName A36
SYMATTR SpiceLine Trise={Trise} Td={Td} Vhigh={Vhigh}
SYMBOL Digital\\or 3824 -1840 R270
SYMATTR InstName A37
SYMATTR SpiceLine Trise={Trise} Td={Td} Vhigh={Vhigh}
SYMBOL Digital\\or 4176 -1840 R270
SYMATTR InstName A38
SYMATTR SpiceLine Trise={Trise} Td={Td} Vhigh={Vhigh}
SYMBOL my_comparator 912 -80 R0
SYMATTR InstName X1
SYMBOL voltage 1088 -336 R0
WINDOW 123 0 0 Left 0
WINDOW 39 0 0 Left 0
SYMATTR InstName V5
SYMATTR Value 1.8
SYMBOL voltage 800 -112 R90
WINDOW 0 -32 56 VBottom 2
WINDOW 3 32 56 VTop 2
WINDOW 123 0 0 Left 0
WINDOW 39 0 0 Left 0
SYMATTR InstName V6
SYMATTR Value {common}
SYMBOL voltage 800 -64 R90
WINDOW 0 -32 56 VBottom 2
WINDOW 3 32 56 VTop 2
WINDOW 123 0 0 Left 0
WINDOW 39 0 0 Left 0
SYMATTR InstName V7
SYMATTR Value {common}
TEXT -1008 824 Left 2 !;tran 0 13u 0 1n
TEXT -1008 872 Left 2 !.model SW SW(Ron=0.1 Roff=1G Vt=.5 Vh=-.4)
TEXT -1008 928 Left 2 !.meas tran reg1 find V(DOUT) AT=200n
TEXT -1008 712 Left 2 !.param Trise=30p\n.param Td=Trise
TEXT -680 648 Left 2 !.param Vhigh=1\n.param Vlow=0
TEXT 1248 888 Left 2 !*PULSE(0 {Vhigh} 0 12.8u 0 0.2u 13u)
TEXT -1008 648 Left 2 !.param common = 0.9
TEXT 1272 944 Left 2 !*SINE(0.5 0.5 {fin} 0 0 90 0)
TEXT 1632 864 Left 2 !.options plotwinsize = 0\n.options numdgt = 15
TEXT 328 1016 Left 2 !.FOUR {fin} 5 -1 V(DOUT)
TEXT 768 1184 Left 2 !*.param fin = 991219.9375\n.param fin = 1Meg
TEXT 1152 1152 Left 2 !.noise V(DOUT) VIN dec 100 1 5Meg

my_comparator.asc, the sub-circuit schematic file:
Version 4
SHEET 1 2728 992
WIRE 80 -400 -64 -400
WIRE 128 -400 80 -400
WIRE 320 -400 128 -400
WIRE 384 -400 320 -400
WIRE 1248 -400 384 -400
WIRE 1312 -400 1248 -400
WIRE 1696 -400 1312 -400
WIRE 1760 -400 1696 -400
WIRE 1248 -384 1248 -400
WIRE 1312 -384 1312 -400
WIRE 1696 -384 1696 -400
WIRE 1760 -384 1760 -400
WIRE 80 -352 80 -400
WIRE 128 -352 128 -400
WIRE 320 -352 320 -400
WIRE 384 -352 384 -400
WIRE 1248 -352 1248 -368
WIRE 1760 -352 1760 -368
WIRE 1040 -336 928 -336
WIRE 1200 -336 1056 -336
WIRE 1920 -336 1808 -336
WIRE 2080 -336 1936 -336
WIRE 80 -304 80 -336
WIRE 384 -304 384 -336
WIRE 1280 -304 1248 -304
WIRE 1312 -304 1312 -368
WIRE 1312 -304 1296 -304
WIRE 1696 -304 1696 -368
WIRE 1712 -304 1696 -304
WIRE 1760 -304 1728 -304
WIRE -32 -288 -64 -288
WIRE 32 -288 -16 -288
WIRE 480 -288 432 -288
WIRE 528 -288 496 -288
WIRE 128 -256 128 -336
WIRE 128 -256 80 -256
WIRE 320 -256 320 -336
WIRE 384 -256 320 -256
WIRE 1248 -240 1248 -256
WIRE 1312 -240 1312 -304
WIRE 1120 -208 1024 -208
WIRE 1248 -208 1248 -224
WIRE 1248 -208 1136 -208
WIRE 1760 -208 1760 -256
WIRE 1856 -208 1760 -208
WIRE 1984 -208 1872 -208
WIRE 1024 -192 1024 -208
WIRE 1248 -192 1248 -208
WIRE 1984 -192 1984 -208
WIRE 80 -176 80 -208
WIRE 384 -160 384 -208
WIRE 1312 -160 1312 -224
WIRE 1312 -160 1168 -160
WIRE 1696 -160 1696 -304
WIRE 1792 -160 1696 -160
WIRE 1840 -160 1808 -160
WIRE 1056 -144 1024 -144
WIRE 1088 -144 1072 -144
WIRE 1248 -144 1248 -176
WIRE 1760 -144 1760 -208
WIRE 1936 -144 1920 -144
WIRE 1984 -144 1952 -144
WIRE 1344 -128 1296 -128
WIRE 1376 -128 1360 -128
WIRE 1712 -128 1648 -128
WIRE 928 -112 928 -336
WIRE 944 -112 928 -112
WIRE 976 -112 960 -112
WIRE 2048 -112 2032 -112
WIRE 2080 -112 2080 -336
WIRE 2080 -112 2064 -112
WIRE 1168 -96 1168 -160
WIRE 1248 -96 1168 -96
WIRE 1840 -96 1840 -160
WIRE 1840 -96 1760 -96
WIRE 80 -80 80 -160
WIRE 480 -80 80 -80
WIRE 736 -80 496 -80
WIRE 1024 -80 1024 -96
WIRE 1040 -80 1024 -80
WIRE 1088 -80 1088 -144
WIRE 1088 -80 1056 -80
WIRE 1920 -80 1920 -144
WIRE 1952 -80 1920 -80
WIRE 1984 -80 1984 -96
WIRE 1984 -80 1968 -80
WIRE 1648 -64 1648 -128
WIRE 2080 -48 2080 -112
WIRE 736 -32 736 -80
WIRE 928 -32 928 -112
WIRE 928 -32 736 -32
WIRE 1248 -32 1248 -48
WIRE 1760 -32 1760 -48
WIRE 80 0 80 -80
WIRE 384 16 384 -144
WIRE 720 16 384 16
WIRE 2080 16 2080 -32
WIRE 2080 16 736 16
WIRE 384 80 384 16
WIRE 1248 80 1248 -16
WIRE 1472 80 1248 80
WIRE 1648 80 1648 -48
WIRE 1648 80 1488 80
WIRE 1248 112 1248 80
WIRE 80 160 80 16
WIRE 384 160 384 96
WIRE 1168 160 1120 160
WIRE 1248 160 1248 128
WIRE 1248 160 1184 160
WIRE 1760 160 1760 -16
WIRE 1824 160 1760 160
WIRE 1888 160 1840 160
WIRE 928 176 928 -32
WIRE 1648 192 1648 80
WIRE 144 208 80 208
WIRE 272 208 160 208
WIRE 320 208 272 208
WIRE 384 208 336 208
WIRE 1760 208 1760 160
WIRE 2080 208 2080 16
WIRE -16 240 -64 240
WIRE 32 240 0 240
WIRE 480 240 432 240
WIRE 560 240 496 240
WIRE 80 272 80 256
WIRE 128 272 80 272
WIRE 224 272 144 272
WIRE 320 272 224 272
WIRE 384 272 384 256
WIRE 384 272 336 272
WIRE 1248 272 1248 160
WIRE 1376 272 1376 -128
WIRE 1520 272 1376 272
WIRE 1760 272 1760 224
WIRE 1760 272 1536 272
WIRE 1760 320 1760 272
WIRE 224 384 224 272
WIRE 272 384 272 208
WIRE 1248 400 1248 288
WIRE 1248 400 1024 400
WIRE 1760 400 1760 336
WIRE 1984 400 1760 400
WIRE 1024 416 1024 400
WIRE 1248 416 1248 400
WIRE 1760 416 1760 400
WIRE 1984 416 1984 400
WIRE 224 464 224 400
WIRE 1024 464 1024 432
WIRE 1248 464 1248 432
WIRE 1760 464 1760 432
WIRE 1984 464 1984 432
WIRE 240 512 224 512
WIRE 272 512 272 400
WIRE 272 512 256 512
WIRE 1072 512 1024 512
WIRE 1248 512 1184 512
WIRE 1824 512 1760 512
WIRE 1984 512 1936 512
WIRE 128 544 96 544
WIRE 176 544 144 544
WIRE 928 544 928 192
WIRE 976 544 928 544
WIRE 1344 544 1296 544
WIRE 1376 544 1376 272
WIRE 1376 544 1360 544
WIRE 1648 544 1648 208
WIRE 1712 544 1648 544
WIRE 2080 544 2080 224
WIRE 2080 544 2032 544
WIRE 224 592 224 560
WIRE 272 592 272 512
WIRE 1024 592 1024 560
WIRE 1072 592 1072 512
WIRE 1184 592 1184 512
WIRE 1248 592 1248 560
WIRE 1760 592 1760 560
WIRE 1824 592 1824 512
WIRE 1936 592 1936 512
WIRE 1984 592 1984 560
WIRE 224 656 224 608
WIRE 224 656 -64 656
WIRE 272 656 272 608
WIRE 272 656 224 656
WIRE 1024 656 1024 608
WIRE 1024 656 272 656
WIRE 1072 656 1072 608
WIRE 1072 656 1024 656
WIRE 1184 656 1184 608
WIRE 1184 656 1072 656
WIRE 1248 656 1248 608
WIRE 1248 656 1184 656
WIRE 1760 656 1760 608
WIRE 1760 656 1248 656
WIRE 1824 656 1824 608
WIRE 1824 656 1760 656
WIRE 1936 656 1936 608
WIRE 1936 656 1824 656
WIRE 1984 656 1984 608
WIRE 1984 656 1936 656
FLAG -64 -400 VDD
IOPIN -64 -400 In
FLAG -64 -288 CLK
IOPIN -64 -288 In
FLAG -64 240 VINP
IOPIN -64 240 In
FLAG -64 656 VSS
IOPIN -64 656 In
FLAG 560 240 VINN
IOPIN 560 240 In
FLAG 96 544 CLK
IOPIN 96 544 In
FLAG 528 -288 CLK
IOPIN 528 -288 In
FLAG 1088 -80 VSS
IOPIN 1088 -80 In
FLAG 1120 160 VOUTP
IOPIN 1120 160 Out
FLAG 1920 -80 VSS
IOPIN 1920 -80 In
FLAG 1888 160 VOUTN
IOPIN 1888 160 Out
SYMBOL nmos4 432 160 M0
SYMATTR InstName M2
SYMATTR Value CMOSN
SYMATTR Value2 l={L2} w={W2} m={M2}
SYMBOL nmos4 176 464 R0
SYMATTR InstName M3
SYMATTR Value CMOSN
SYMATTR Value2 l={L3} w={W3} m={M3}
SYMBOL pmos4 32 -208 M180
SYMATTR InstName M4
SYMATTR Value CMOSP
SYMATTR Value2 l={L4} w={W4} m={M4}
SYMBOL pmos4 432 -208 R180
SYMATTR InstName M5
SYMATTR Value CMOSP
SYMATTR Value2 l={L5} w={W5} m={M5}
SYMBOL nmos4 32 160 R0
SYMATTR InstName M1
SYMATTR Value CMOSN
SYMATTR Value2 l={L1} w={W1} m={M1}
SYMBOL nmos4 976 464 R0
SYMATTR InstName M6
SYMATTR Value CMOSN
SYMATTR Value2 l={L6} w={W6} m={M6}
SYMBOL nmos4 1296 464 M0
SYMATTR InstName M7
SYMATTR Value CMOSN
SYMATTR Value2 l={L7} w={W7} m={M7}
SYMBOL nmos4 976 -192 R0
SYMATTR InstName M8
SYMATTR Value CMOSN
SYMATTR Value2 l={L8} w={W8} m={M8}
SYMBOL pmos4 1296 -48 R180
SYMATTR InstName M9
SYMATTR Value CMOSP
SYMATTR Value2 l={L9} w={W9} m={M9}
SYMBOL pmos4 1200 -256 M180
SYMATTR InstName M10
SYMATTR Value CMOSP
SYMATTR Value2 l={L10} w={W10} m={M10}
SYMBOL nmos4 2032 464 M0
SYMATTR InstName M11
SYMATTR Value CMOSN
SYMATTR Value2 l={L11} w={W11} m={M11}
SYMBOL nmos4 1712 464 R0
SYMATTR InstName M12
SYMATTR Value CMOSN
SYMATTR Value2 l={L12} w={W12} m={M12}
SYMBOL nmos4 2032 -192 M0
SYMATTR InstName M13
SYMATTR Value CMOSN
SYMATTR Value2 l={L13} w={W13} m={M13}
SYMBOL pmos4 1712 -48 M180
SYMATTR InstName M14
SYMATTR Value CMOSP
SYMATTR Value2 l={L14} w={W14} m={M14}
SYMBOL pmos4 1808 -256 R180
SYMATTR InstName M15
SYMATTR Value CMOSP
SYMATTR Value2 l={L15} w={W15} m={M15}
SYMBOL para_register 64 -352 R90
SYMATTR InstName X1
SYMBOL para_register 112 -352 R90
SYMATTR InstName X2
SYMBOL para_register 304 -352 R90
SYMATTR InstName X3
SYMBOL para_register 368 -352 R90
SYMATTR InstName X4
SYMBOL para_register -16 -304 R180
SYMATTR InstName X5
SYMBOL para_register 496 -304 R180
SYMATTR InstName X6
SYMBOL para_register 96 -160 R270
SYMATTR InstName X7
SYMBOL para_register 400 -144 R270
SYMATTR InstName X8
SYMBOL para_register 96 16 R270
SYMATTR InstName X9
SYMBOL para_register 400 96 R270
SYMATTR InstName X10
SYMBOL para_register -16 256 R0
SYMATTR InstName X11
SYMBOL para_register 144 224 R0
SYMATTR InstName X12
SYMBOL para_register 320 224 R0
SYMATTR InstName X13
SYMBOL para_register 480 256 R0
SYMATTR InstName X14
SYMBOL para_register 128 288 R0
SYMATTR InstName X15
SYMBOL para_register 320 288 R0
SYMATTR InstName X16
SYMBOL para_register 208 384 R90
SYMATTR InstName X17
SYMBOL para_register 256 384 R90
SYMATTR InstName X18
SYMBOL para_register 144 528 R180
SYMATTR InstName X19
SYMBOL para_register 256 496 R180
SYMATTR InstName X20
SYMBOL para_register 208 592 R90
SYMATTR InstName X21
SYMBOL para_register 256 592 R90
SYMATTR InstName X22
SYMBOL para_register 480 -64 R0
SYMATTR InstName X23
SYMBOL para_register 720 32 R0
SYMATTR InstName X24
SYMBOL para_register 1232 -384 R90
SYMATTR InstName X25
SYMBOL para_register 1296 -384 R90
SYMATTR InstName X26
SYMBOL para_register 1680 -384 R90
SYMATTR InstName X27
SYMBOL para_register 1744 -384 R90
SYMATTR InstName X28
SYMBOL para_register 1040 -320 R0
SYMATTR InstName X29
SYMBOL para_register 1280 -288 R0
SYMATTR InstName X30
SYMBOL para_register 1232 -240 R90
SYMATTR InstName X31
SYMBOL para_register 1296 -240 R90
SYMATTR InstName X32
SYMBOL para_register 1136 -224 R180
SYMATTR InstName X33
SYMBOL para_register 1232 -192 R90
SYMATTR InstName X34
SYMBOL para_register 944 -96 R0
SYMATTR InstName X35
SYMBOL para_register 1056 -128 R0
SYMATTR InstName X36
SYMBOL para_register 1040 -64 R0
SYMATTR InstName X37
SYMBOL para_register 1344 -112 R0
SYMATTR InstName X38
SYMBOL para_register 944 192 R270
SYMATTR InstName X39
SYMBOL para_register 1264 -16 R270
SYMATTR InstName X40
SYMBOL para_register 1264 128 R270
SYMATTR InstName X41
SYMBOL para_register 1264 288 R270
SYMATTR InstName X42
SYMBOL para_register 1040 432 R270
SYMATTR InstName X43
SYMBOL para_register 1264 432 R270
SYMATTR InstName X44
SYMBOL para_register 1040 608 R270
SYMATTR InstName X45
SYMBOL para_register 1088 608 R270
SYMATTR InstName X46
SYMBOL para_register 1200 608 R270
SYMATTR InstName X47
SYMBOL para_register 1264 608 R270
SYMATTR InstName X48
SYMBOL para_register 1344 560 R0
SYMATTR InstName X49
SYMBOL para_register 1472 96 R0
SYMATTR InstName X50
SYMBOL para_register 1520 288 R0
SYMATTR InstName X51
SYMBOL para_register 1168 176 R0
SYMATTR InstName X52
SYMBOL para_register 1712 -288 R0
SYMATTR InstName X53
SYMBOL para_register 1920 -320 R0
SYMATTR InstName X54
SYMBOL para_register 1792 -144 R0
SYMATTR InstName X55
SYMBOL para_register 1856 -192 R0
SYMATTR InstName X56
SYMBOL para_register 1936 -128 R0
SYMATTR InstName X57
SYMBOL para_register 1952 -64 R0
SYMATTR InstName X58
SYMBOL para_register 2048 -96 R0
SYMATTR InstName X59
SYMBOL para_register 1664 -48 R270
SYMATTR InstName X60
SYMBOL para_register 1776 -16 R270
SYMATTR InstName X61
SYMBOL para_register 2096 -32 R270
SYMATTR InstName X62
SYMBOL para_register 1664 208 R270
SYMATTR InstName X63
SYMBOL para_register 1824 176 R0
SYMATTR InstName X64
SYMBOL para_register 1744 208 R90
SYMATTR InstName X65
SYMBOL para_register 1744 320 R90
SYMATTR InstName X66
SYMBOL para_register 2064 208 R90
SYMATTR InstName X67
SYMBOL para_register 1744 416 R90
SYMATTR InstName X68
SYMBOL para_register 1968 416 R90
SYMATTR InstName X69
SYMBOL para_register 1744 592 R90
SYMATTR InstName X70
SYMBOL para_register 1808 592 R90
SYMATTR InstName X71
SYMBOL para_register 1920 592 R90
SYMATTR InstName X72
SYMBOL para_register 1968 592 R90
SYMATTR InstName X73
TEXT 2352 -856 Left 2 !.param L = 0.18u\n.param L1 = L\n.param W1 = L1*10\n.param M1 = 1\n.param L2 = L\n.param W2 = L2*10\n.param M2 = 1\n.param L3 = L\n.param W3 = L3*10\n.param M3 = 1\n.param L4 = L\n.param W4 = L4*10\n.param M4 = 1\n.param L5 = L\n.param W5 = L5*10\n.param M5 = 1\n.param L6 = L\n.param W6 = L6*10\n.param M6 = 1\n.param L7 = L\n.param W7 = L7*10\n.param M7 = 1\n.param L8 = L\n.param W8 = L8*10\n.param M8 = 1\n.param L9 = L\n.param W9 = L9*10\n.param M9 = 1\n.param L10 = L\n.param W10 = L10*10\n.param M10 = 1\n.param L11 = L\n.param W11 = L11*10\n.param M11 = 1\n.param L12 = L\n.param W12 = L12*10\n.param M12 = 1\n.param L13 = L\n.param W13 = L13*10\n.param M13 = 1\n.param L14 = L\n.param W14 = L14*10\n.param M14 = 1\n.param L15 = L\n.param W15 = L15*10\n.param M15 = 1
TEXT 1760 -640 Left 2 !.include tsmc018.mdl

para_register.asc, the sub-circuit schematic file:
Version 4
SHEET 1 880 680
WIRE 160 -176 128 -176
WIRE 272 -176 240 -176
FLAG 128 -176 in
IOPIN 128 -176 In
FLAG 272 -176 out
IOPIN 272 -176 Out
SYMBOL res 256 -192 R90
WINDOW 0 0 56 VBottom 2
WINDOW 3 32 56 VTop 2
SYMATTR InstName R1
SYMATTR Value 0.0001

The netlist it stands for:
* saradc.asc
C1 N031 N040 320f
S1 N040 N041 SW5 0 SW
S2 N040 0 SW5B 0 SW
C2 N031 N039 160f
S3 N039 N041 SW4 0 SW
S4 N039 0 SW4B 0 SW
C3 N031 N038 80f
S5 N038 N041 SW3 0 SW
S6 N038 0 SW3B 0 SW
C4 N031 N037 40f
S7 N037 N041 SW2 0 SW
S8 N037 0 SW2B 0 SW
C5 N031 N036 20f
S9 N036 N041 SW1 0 SW
S10 N036 0 SW1B 0 SW
C6 N031 N035 10f
S11 N035 N041 SW0 0 SW
S12 N035 0 SW0B 0 SW
C7 N031 N034 10f
S13 N034 N041 Sample 0 SW
S14 N034 0 COMP_ENB 0 SW
S15 N041 N042 COMP_ENB 0 SW
S16 N041 Vin Sample 0 SW
V1 CLK 0 PULSE(0 {Vhigh} 0 30p 30p 5.55n 11.11n)
V2 N042 0 {Vhigh}
VIN Vin 0 SINE(0.5 0.5 {fin} 0 0 90 0)
S17 0 N031 Sample 0 SW
A1 CLK COMP_EN 0 0 0 N033 0 0 OR Trise={Trise} Td={Td} Vhigh={Vhigh}
A2 COMP_EN 0 0 0 0 COMP_ENB 0 0 BUF Vt=.5 Vh=0.1 Trise={Trise} Vhigh={Vhigh}
B1 DOUT 0 V=(32*V(Q05)+16*V(Q04)+8*V(Q03)+4*V(Q02)+2*V(Q01)+V(Q00))/63
A3 TIHI 0 CLK 0 CLR N013 N020 0 DFLOP Vhigh={Vhigh} Vlow={Vlow} Td={Td} Trise={Trise}
A4 0 TIHI 0 N013 0 0 Sample 0 AND Trise={Trise} Td={Td} Vhigh={Vhigh}
A5 Sample D6 N001 0 0 SW5B SW5 0 OR Trise={Trise} Td={Td} Vhigh={Vhigh}
V4 TIHI 0 {Vhigh}
A6 CLK 0 0 0 0 N028 0 0 BUF Trise={Trise} Vhigh={Vhigh}
A7 N020 0 CLK 0 N027 COMP_EN N021 0 DFLOP Vhigh={Vhigh} Vlow={Vlow} Td={Td} Trise={Trise}
A8 N021 0 CLK 0 CLR N014 N022 0 DFLOP Vhigh={Vhigh} Vlow={Vlow} Td={Td} Trise={Trise}
A9 N022 0 CLK 0 CLR N015 N023 0 DFLOP Vhigh={Vhigh} Vlow={Vlow} Td={Td} Trise={Trise}
A10 N023 0 CLK 0 CLR N016 N024 0 DFLOP Vhigh={Vhigh} Vlow={Vlow} Td={Td} Trise={Trise}
A11 N024 0 CLK 0 CLR N017 N025 0 DFLOP Vhigh={Vhigh} Vlow={Vlow} Td={Td} Trise={Trise}
A12 N025 0 CLK 0 CLR N018 N026 0 DFLOP Vhigh={Vhigh} Vlow={Vlow} Td={Td} Trise={Trise}
A13 N026 0 CLK 0 CLR N019 N027 0 DFLOP Vhigh={Vhigh} Vlow={Vlow} Td={Td} Trise={Trise}
A14 N027 0 N028 0 0 0 CLR 0 DFLOP Vhigh={Vhigh} Vlow={Vlow} Td={Td} Trise={Trise}
A15 COMP_IN 0 N007 0 Sample 0 N001 0 DFLOP Vhigh={Vhigh} Vlow={Vlow} Td={Td} Trise={Trise}
A16 COMP_IN 0 N008 0 Sample 0 N002 0 DFLOP Vhigh={Vhigh} Vlow={Vlow} Td={Td} Trise={Trise}
A17 COMP_IN 0 N009 0 Sample 0 N003 0 DFLOP Vhigh={Vhigh} Vlow={Vlow} Td={Td} Trise={Trise}
A18 COMP_IN 0 N010 0 Sample 0 N004 0 DFLOP Vhigh={Vhigh} Vlow={Vlow} Td={Td} Trise={Trise}
A19 COMP_IN 0 N011 0 Sample 0 N005 0 DFLOP Vhigh={Vhigh} Vlow={Vlow} Td={Td} Trise={Trise}
A20 COMP_IN 0 N012 0 Sample 0 N006 0 DFLOP Vhigh={Vhigh} Vlow={Vlow} Td={Td} Trise={Trise}
A21 N001 0 CLR 0 0 0 Q05 0 DFLOP Vhigh={Vhigh} Vlow={Vlow} Td={Td} Trise={Trise}
A22 N002 0 CLR 0 0 0 Q04 0 DFLOP Vhigh={Vhigh} Vlow={Vlow} Td={Td} Trise={Trise}
A23 N003 0 CLR 0 0 0 Q03 0 DFLOP Vhigh={Vhigh} Vlow={Vlow} Td={Td} Trise={Trise}
A24 N004 0 CLR 0 0 0 Q02 0 DFLOP Vhigh={Vhigh} Vlow={Vlow} Td={Td} Trise={Trise}
A25 N005 0 CLR 0 0 0 Q01 0 DFLOP Vhigh={Vhigh} Vlow={Vlow} Td={Td} Trise={Trise}
A26 N006 0 CLR 0 0 0 Q00 0 DFLOP Vhigh={Vhigh} Vlow={Vlow} Td={Td} Trise={Trise}
A27 0 N020 0 COMP_EN 0 0 N0V 0 AND Trise={Trise} Td={Td} Vhigh={Vhigh}
A28 0 N021 0 N014 0 N007 D6 0 AND Trise={Trise} Td={Td} Vhigh={Vhigh}
A29 0 N022 0 N015 0 N008 D5 0 AND Trise={Trise} Td={Td} Vhigh={Vhigh}
A30 0 N023 0 N016 0 N009 D4 0 AND Trise={Trise} Td={Td} Vhigh={Vhigh}
A31 0 N024 0 N017 0 N010 D3 0 AND Trise={Trise} Td={Td} Vhigh={Vhigh}
A32 0 N025 0 N018 0 N011 D2 0 AND Trise={Trise} Td={Td} Vhigh={Vhigh}
A33 0 N026 0 N019 0 N012 D1 0 AND Trise={Trise} Td={Td} Vhigh={Vhigh}
A34 Sample D5 N002 0 0 SW4B SW4 0 OR Trise={Trise} Td={Td} Vhigh={Vhigh}
A35 Sample D4 N003 0 0 SW3B SW3 0 OR Trise={Trise} Td={Td} Vhigh={Vhigh}
A36 Sample D3 N004 0 0 SW2B SW2 0 OR Trise={Trise} Td={Td} Vhigh={Vhigh}
A37 Sample D2 N005 0 0 SW1B SW1 0 OR Trise={Trise} Td={Td} Vhigh={Vhigh}
A38 Sample D1 N006 0 0 SW0B SW0 0 OR Trise={Trise} Td={Td} Vhigh={Vhigh}
XX1 N033 N029 N032 N030 0 outn COMP_IN my_comparator
V5 N029 0 1.8
V6 N030 0 {common}
V7 N032 N031 {common}

* block symbol definitions
.subckt my_comparator CLK VDD VINN VINP VSS VOUTN VOUTP
M2 N044 N051 N054 N049 CMOSN l={L2} w={W2} m={M2}
M3 N058 N069 N074 N063 CMOSN l={L3} w={W3} m={M3}
M4 N022 N013 N007 N015 CMOSP l={L4} w={W4} m={M4}
M5 N023 N014 N008 N016 CMOSP l={L5} w={W5} m={M5}
M1 N043 N050 N052 N047 CMOSN l={L1} w={W1} m={M1}
M6 N059 N070 N075 N065 CMOSN l={L6} w={W6} m={M6}
M7 N060 N071 N076 N066 CMOSN l={L7} w={W7} m={M7}
M8 N018 N032 N035 N026 CMOSN l={L8} w={W8} m={M8}
M9 N037 N029 N027 N024 CMOSP l={L9} w={W9} m={M9}
M10 N017 N004 N001 N009 CMOSP l={L10} w={W10} m={M10}
M11 N062 N073 N078 N068 CMOSN l={L11} w={W11} m={M11}
M12 N061 N072 N077 N067 CMOSN l={L12} w={W12} m={M12}
M13 N021 N033 N036 N028 CMOSN l={L13} w={W13} m={M13}
M14 N038 N031 N020 N025 CMOSP l={L14} w={W14} m={M14}
M15 N020 N005 N002 N012 CMOSP l={L15} w={W15} m={M15}
XX1 VDD N007 para_register
XX2 VDD N015 para_register
XX3 VDD N016 para_register
XX4 VDD N008 para_register
XX5 N013 CLK para_register
XX6 CLK N014 para_register
XX7 N034 N022 para_register
XX8 N039 N023 para_register
XX9 N043 N034 para_register
XX10 N044 N039 para_register
XX11 VINP N050 para_register
XX12 N047 N048 para_register
XX13 N048 N049 para_register
XX14 N051 VINN para_register
XX15 N052 N053 para_register
XX16 N053 N054 para_register
XX17 N053 N058 para_register
XX18 N048 N064 para_register
XX19 N069 CLK para_register
XX20 N064 N063 para_register
XX21 N074 VSS para_register
XX22 N064 VSS para_register
XX23 N034 N003 para_register
XX24 N039 N040 para_register
XX25 VDD N001 para_register
XX26 VDD N010 para_register
XX27 VDD N011 para_register
XX28 VDD N002 para_register
XX29 N003 N004 para_register
XX30 N009 N010 para_register
XX31 N017 N019 para_register
XX32 N010 N024 para_register
XX33 N019 N018 para_register
XX34 N019 N027 para_register
XX35 N003 N032 para_register
XX36 N026 VSS para_register
XX37 N035 VSS para_register
XX38 N029 N030 para_register
XX39 N070 N003 para_register
XX40 N041 N037 para_register
XX41 N045 N041 para_register
XX42 N056 N045 para_register
XX43 N059 N056 para_register
XX44 N060 N056 para_register
XX45 VSS N075 para_register
XX46 VSS N065 para_register
XX47 VSS N066 para_register
XX48 VSS N076 para_register
XX49 N071 N030 para_register
XX50 N041 N042 para_register
XX51 N030 N055 para_register
XX52 VOUTP N045 para_register
XX53 N011 N012 para_register
XX54 N005 N006 para_register
XX55 N011 N025 para_register
XX56 N020 N021 para_register
XX57 VSS N028 para_register
XX58 VSS N036 para_register
XX59 N033 N006 para_register
XX60 N042 N031 para_register
XX61 N046 N038 para_register
XX62 N040 N006 para_register
XX63 N072 N042 para_register
XX64 N046 VOUTN para_register
XX65 N046 N055 para_register
XX66 N055 N057 para_register
XX67 N040 N073 para_register
XX68 N057 N061 para_register
XX69 N057 N062 para_register
XX70 N077 VSS para_register
XX71 N067 VSS para_register
XX72 N068 VSS para_register
XX73 N078 VSS para_register
.param L = 0.18u
.param L1 = L
.param W1 = L1*10
.param M1 = 1
.param L2 = L
.param W2 = L2*10
.param M2 = 1
.param L3 = L
.param W3 = L3*10
.param M3 = 1
.param L4 = L
.param W4 = L4*10
.param M4 = 1
.param L5 = L
.param W5 = L5*10
.param M5 = 1
.param L6 = L
.param W6 = L6*10
.param M6 = 1
.param L7 = L
.param W7 = L7*10
.param M7 = 1
.param L8 = L
.param W8 = L8*10
.param M8 = 1
.param L9 = L
.param W9 = L9*10
.param M9 = 1
.param L10 = L
.param W10 = L10*10
.param M10 = 1
.param L11 = L
.param W11 = L11*10
.param M11 = 1
.param L12 = L
.param W12 = L12*10
.param M12 = 1
.param L13 = L
.param W13 = L13*10
.param M13 = 1
.param L14 = L
.param W14 = L14*10
.param M14 = 1
.param L15 = L
.param W15 = L15*10
.param M15 = 1
.include tsmc018.mdl
.ends my_comparator

.subckt para_register in out
R1 out in 0.0001
.ends para_register

.model NMOS NMOS
.model PMOS PMOS
.lib standard.mos
;tran 0 13u 0 1n
.model SW SW(Ron=0.1 Roff=1G Vt=.5 Vh=-.4)
.meas tran reg1 find V(DOUT) AT=200n
.param Trise=30p
.param Td=Trise
.param Vhigh=1
.param Vlow=0
*PULSE(0 {Vhigh} 0 12.8u 0 0.2u 13u)
.param common = 0.9
*SINE(0.5 0.5 {fin} 0 0 90 0)
.options plotwinsize = 0
.options numdgt = 15
.FOUR {fin} 5 -1 V(DOUT)
*.param fin = 991219.9375
.param fin = 1Meg
.noise V(DOUT) VIN dec 100 1 5Meg
.backanno
.end